# Altium schematic sheet MB_sensors.SchDoc
size A
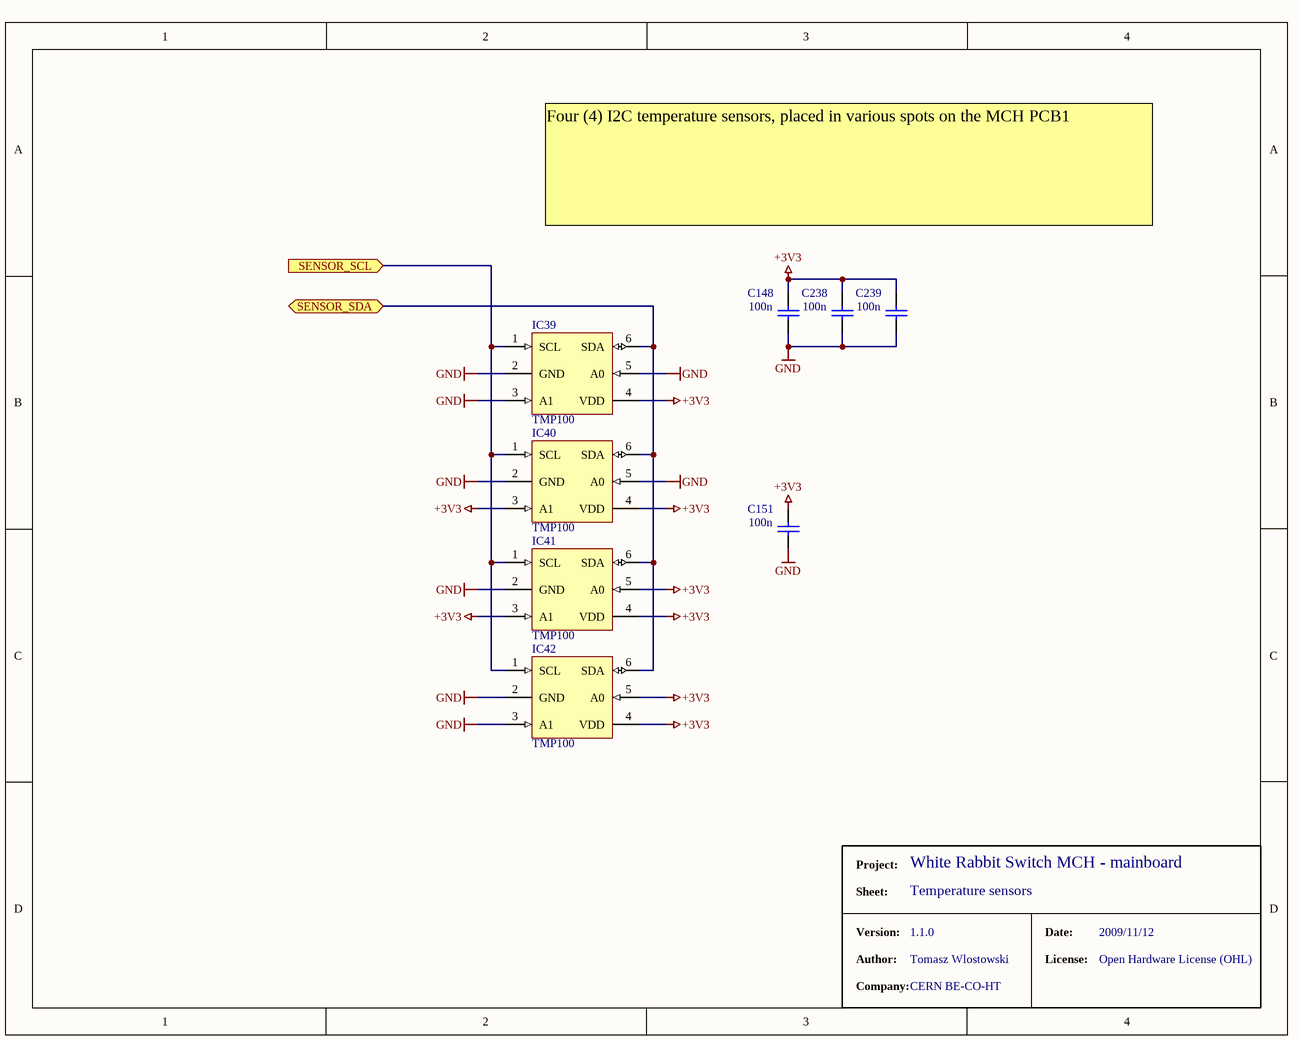
[diagram p0: MB_sensors.SchDoc]

## Parts
C148  100n  [CAPC1005X55N]
C151  100n  [CAPC1005X55N]
C238  100n  [CAPC1005X55N]
C239  100n  [CAPC1005X55N]
IC39  TMP100  [SOT23A-6L]
IC40  TMP100  [SOT23A-6L]
IC41  TMP100  [SOT23A-6L]
IC42  TMP100  [SOT23A-6L]

## Ports
SENSOR_SCL (in), SENSOR_SDA (bidir)

## Nets
+3V3: C148.2 C151.2 C238.2 C239.2 IC39.4(VDD) IC40.3(A1) IC40.4(VDD) IC41.3(A1) IC41.4(VDD) IC41.5(A0) IC42.4(VDD) IC42.5(A0)
GND: C148.1 C151.1 C238.1 C239.1 IC39.2(GND) IC39.3(A1) IC39.5(A0) IC40.2(GND) IC40.5(A0) IC41.2(GND) IC42.2(GND) IC42.3(A1)
SENSOR_SCL: IC39.1(SCL) IC40.1(SCL) IC41.1(SCL) IC42.1(SCL) ; port SENSOR_SCL
SENSOR_SDA: IC39.6(SDA) IC40.6(SDA) IC41.6(SDA) IC42.6(SDA) ; port SENSOR_SDA

## Notes on the sheet
- !
- Four (4) I2C temperature sensors, placed in various spots on the MCH PCB1
- Project:
- Sheet:
- Temperature sensors
- White Rabbit Switch MCH - mainboard
- Version:
- Author:
- Company:
- 1.1.0
- Tomasz Wlostowski
- CERN BE-CO-HT
- Date:
- License:
- 2009/11/12
- Open Hardware License (OHL)

## Library data of the parts
C148 C151 C238 C239 = CC0402_100NF_16V_10%_X7R: Non-polarised capacitor; Part Description: SMD Multilayer Chip Ceramic Capacitor; Manufacturer: GENERIC; Manufacturer1 Part Number: 223878715649; Manufacturer1 Datasheet: \\cern.ch\dfs\Applications\Altium\Datasheets\CC0402_X7R_PHYCOMP.pdf; Value: 100nF; Voltage: 16V; TC: X7R; Tolerance: ±10%; Table: Capacitors SMD; Part Number: CC0402_100NF_16V_10%_X7R; Component Kind: Standard; Component Type: Standard; Designator: Capacitor - non polarized; Library Reference: Capacitor - non polarized; Pin Count: 2; Status: Not Recommended; Manufacturer Part Number: CC0402_100NF_16V_10%_X7R; Case: 0402; Mounted: Yes; Socket: No; SMD: Yes; Manufacturer1 Example: PHYCOMP; Manufacturer1 ComponentHeight: 0.55mm; HelpURL: \\cern.ch\dfs\Applications\Altium\Datasheets\CC0402_X7R_PHYCOMP.pdf; Author: CERN DEM JLC; CreateDate: 12/3/2007; LatestRevisionDate: 12/3/2007
IC39-IC42 = TMP100: I2C temp. sensor; RefId: 296-12750-1-ND; Value: TMP101NA/250; Supplier: Digikey